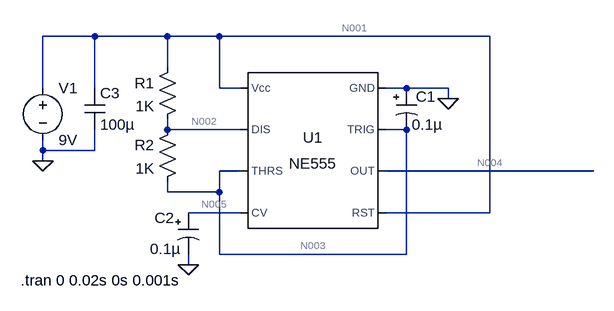
[diagram p0: schematic TENS_Circuit.asc]
TENS_Circuit.asc, the LTspice schematic file:
Version 4
SHEET 1 880 680
WIRE -80 0 -160 0
WIRE 32 0 -80 0
WIRE 112 0 32 0
WIRE 528 0 112 0
WIRE 32 48 32 0
WIRE -160 80 -160 0
WIRE -80 80 -80 0
WIRE 112 80 112 0
WIRE 144 80 112 80
WIRE 400 80 368 80
WIRE 464 80 400 80
WIRE 464 96 464 80
WIRE 32 144 32 128
WIRE 144 144 32 144
WIRE 400 144 368 144
WIRE -160 176 -160 160
WIRE -80 176 -80 144
WIRE -80 176 -160 176
WIRE -160 192 -160 176
WIRE 144 208 112 208
WIRE 688 208 368 208
WIRE 32 240 32 224
WIRE 112 240 112 208
WIRE 112 240 32 240
WIRE 144 272 64 272
WIRE 528 272 528 0
WIRE 528 272 368 272
WIRE 112 336 112 240
WIRE 400 336 400 144
WIRE 400 336 112 336
WIRE 64 352 64 336
FLAG 464 96 0
FLAG -160 192 0
FLAG 64 352 0
SYMBOL Misc\\NE555 256 176 M0
SYMATTR InstName U1
SYMBOL voltage -160 64 R0
WINDOW 123 0 0 Left 2
WINDOW 39 0 0 Left 2
SYMATTR InstName V1
SYMATTR Value 9V
SYMBOL res 48 32 M0
SYMATTR InstName R1
SYMATTR Value 1K
SYMATTR SpiceLine tol=1 pwr=0.1
SYMBOL res 48 128 M0
SYMATTR InstName R2
SYMATTR Value 1K
SYMATTR SpiceLine tol=1 pwr=0.1
SYMBOL polcap 384 80 R0
WINDOW 0 30 13 Left 2
WINDOW 3 24 56 Left 2
SYMATTR InstName C1
SYMATTR Value 0.1µ
SYMATTR Description Capacitor
SYMATTR Type cap
SYMATTR SpiceLine V=50 Irms=0 Rser=0 Lser=0 mfg="TDK" pn="FK28X7R1H104K" type="Ceramic"
SYMBOL polcap 48 272 R0
WINDOW 0 -36 8 Left 2
WINDOW 3 -43 56 Left 2
SYMATTR InstName C2
SYMATTR Value 0.1µ
SYMATTR Description Capacitor
SYMATTR Type cap
SYMATTR SpiceLine V=50 Irms=0 Rser=0 Lser=0 mfg="TDK" pn="FK28X7R1H104K" type="Ceramic"
SYMBOL cap -96 80 R0
SYMATTR InstName C3
SYMATTR Value 100µ
SYMATTR SpiceLine V=50
TEXT -194 376 Left 2 !.tran 0 0.02s 0s 0.001s

The netlist it stands for:
* TENS_Circuit.asc
XU1 0 N003 N004 N001 N005 N003 N002 N001 NE555  ; pins GND TRIG OUT RST CV THRS DIS Vcc
V1 N001 0 9V
R1 N001 N002 1K tol=1 pwr=0.1
R2 N002 N003 1K tol=1 pwr=0.1
C1 0 N003 0.1µ V=50 Irms=0 Rser=0 Lser=0 mfg="TDK" pn="FK28X7R1H104K" type="Ceramic"
C2 N005 0 0.1µ V=50 Irms=0 Rser=0 Lser=0 mfg="TDK" pn="FK28X7R1H104K" type="Ceramic"
C3 N001 0 100µ V=50
.tran 0 0.02s 0s 0.001s
.lib NE555.sub
.backanno
.end

* Results of the author's LTspice run, read from the files saved beside the schematic
* Operating Point, zero values left out:
*   V(n003) = 9 V
*   V(n005) = 6 V
*   V(n001) = 9 V
*   V(n002) = 9 V
*   V(n004) = 9 V
*   I(R2) = 18 nA
*   I(R1) = 30.01 nA
*   I(V1) = -2.908 mA
*   Ix(u1:1) = -2.908 mA
*   Ix(u1:2) = 9 nA
*   Ix(u1:4) = 49.33 µA
*   Ix(u1:6) = 9 nA
*   Ix(u1:7) = 12.01 nA
*   Ix(u1:8) = 2.859 mA
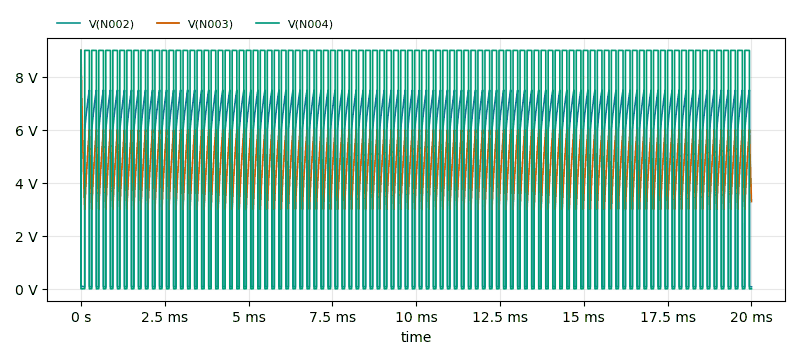
[diagram p1: Transient Analysis of TENS_Circuit.asc, plotted from the saved traces]
* Transient Analysis, 1 run:
*   V(N002): min 71.13 mV, max 9 V, average 4.527 V, rms 5.556 V, last 72.85 mV
*   V(N003): min 2.997 V, max 9 V, average 4.556 V, rms 4.657 V, last 3.287 V
*   V(N004): min 54 µV, max 9 V, average 5.928 V, rms 7.304 V, last 54 µV